# EAGLE schematic Schéma_CI (EAGLE 9.7.0)
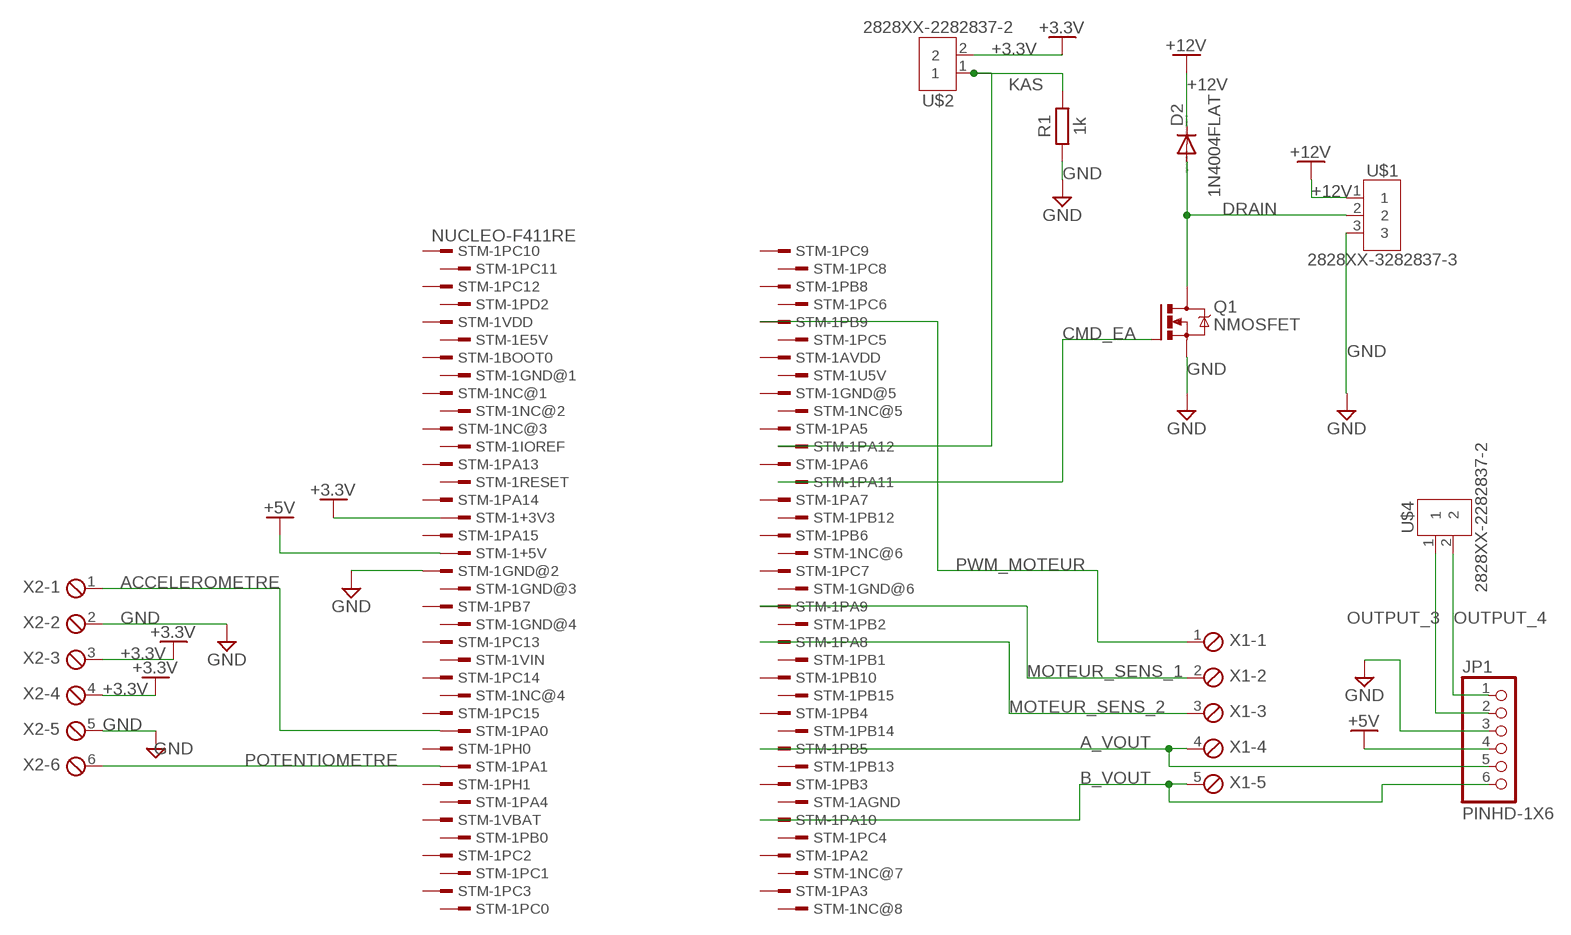
[diagram p0: schematic, sheet 1]

## Parts
D2  1N4004FLAT  [DO41-10]
JP1  PINHD-1X6  [1X06]
Q1  NMOSFET  NMOSFET_TO220  [TO220BV]
R1  1k  R_AXIAL-7.2MM-PITCH  [RESAD724W46L381D178B]
STM-1  NUCLEO-F411RE  [CONN_STM32_NUCLEO]
U$1  2828XX-3282837-3  [TERMBLK_508-3N]
U$2  2828XX-2282837-2  [TERMBLK_508-2N]
U$4  2828XX-2282837-2  [TERMBLK_508-2N]
X1  MPT5  [5POL254]
X2  MPT6  [6POL254]

## Nets
+3.3V: STM-1.16 U$2.2 X2.3 X2.4
+5V: JP1.4 STM-1.18
+12V: D2.C U$1.1
A_VOUT: JP1.5 STM-1.67 X1.4
ACCELEROMETRE: STM-1.28 X2.1
B_VOUT: JP1.6 STM-1.71 X1.5
CMD_EA: Q1.G STM-1.52
DRAIN: D2.A Q1.D U$1.2
GND: JP1.3 Q1.S R1.1 STM-1.19 U$1.3 X2.2 X2.5
KAS: R1.2 STM-1.50 U$2.1
MOTEUR_SENS_1: STM-1.59 X1.2
MOTEUR_SENS_2: STM-1.61 X1.3
OUTPUT_3: JP1.2 U$4.1
OUTPUT_4: JP1.1 U$4.2
POTENTIOMETRE: STM-1.30 X2.6
PWM_MOTEUR: STM-1.43 X1.1
Unconnected: STM-1.1 STM-1.2 STM-1.3 STM-1.4 STM-1.5 STM-1.6 STM-1.7 STM-1.8 STM-1.9 STM-1.10 STM-1.11 STM-1.12 STM-1.13 STM-1.14 STM-1.15 STM-1.17 STM-1.20 STM-1.21 STM-1.22 STM-1.23 STM-1.24 STM-1.25 STM-1.26 STM-1.27 STM-1.29 STM-1.31 STM-1.32 STM-1.33 STM-1.34 STM-1.35 STM-1.36 STM-1.37 STM-1.38 STM-1.39 STM-1.40 STM-1.41 STM-1.42 STM-1.44 STM-1.45 STM-1.46 STM-1.47 STM-1.48 STM-1.49 STM-1.51 STM-1.53 STM-1.54 STM-1.55 STM-1.56 STM-1.57 STM-1.58 STM-1.60 STM-1.62 STM-1.63 STM-1.64 STM-1.65 STM-1.66 STM-1.68 STM-1.69 STM-1.70 STM-1.72 STM-1.73 STM-1.74 STM-1.75 STM-1.76

## Library data of the parts
D2 = 1N4004:1N4004: DIODE general purpose rectifier, 1 A
JP1 = Connector:PINHD-1X6: PIN HEADER; CATEGORY: CONNECTOR; SUB-CATEGORY: PIN-HEADER
Q1 = Transistor:NMOSFET: N-Channel MOSFET - Generic; CATEGORY: Transistor; SUB-CATEGORY: MOSFET; TYPE: N-Channel
R1 = Resistor:R: Resistor Fixed - Generic; CATEGORY: Resistor; SUB-CATEGORY: Fixed
STM-1 = prj-ips-jmb:NUCLEO-F411RE
U$1 = Connector:2828XX-3: 3 Position Wire to Board Terminal Block Horizontal with Board Datasheet <https://www.te.com.cn/commerce/DocumentDelivery/DDEController?Action=showdoc&DocId=Catalog+Section%7F1308389_EUROSTYLE_TERMINAL_BLOCKS%7F0607%7Fpdf%7FEnglish%7FENG_CS_1308389_EUROSTYLE_TERMINAL_BLOCKS_0607.pdf%7F2-282837-5>; CATEGORY: Connector; DESCRIPTION: TERM BLK 3P SIDE ENT 5.08mm PCB; MANUFACTURER: TE Connectivity; MPN: 282837-3; OPERATING_TEMPERATURE: -40°C to +105°C; PART_STATUS: Active; ROHS_COMPLIANCE: RoHS Compliant; SERIES: 282837; SUBCATEGORY: Terminal Block; TYPE: Side Wire Entry
U$2 U$4 = Connector:2828XX-2: 2 Position Wire to Board Terminal Block Horizontal with Board Datasheet <https://www.te.com.cn/commerce/DocumentDelivery/DDEController?Action=showdoc&DocId=Catalog+Section%7F1308389_EUROSTYLE_TERMINAL_BLOCKS%7F0607%7Fpdf%7FEnglish%7FENG_CS_1308389_EUROSTYLE_TERMINAL_BLOCKS_0607.pdf%7F2-282837-5>; CATEGORY: Connector; DESCRIPTION: 2 Position Wire to Board Terminal Block Horizontal with Board 5.08 mm Through Hole; MANUFACTURER: TE Connectivity; MPN: 282837-2; OPERATING_TEMPERATURE: -40°C to +105°C; PART_STATUS: ACTIVE; ROHS_COMPLIANCE: RoHS Compliant; SERIES: 282837; SUBCATEGORY: Terminal Block; TYPE: Side Wire Entry
X1 = con-phoenix-254:MPT5: PHOENIX CONNECTOR; OC_FARNELL: unknown; OC_NEWARK: unknown
X2 = con-phoenix-254:MPT6: PHOENIX CONNECTOR; OC_FARNELL: unknown; OC_NEWARK: unknown